# EasyEDA schematic SCH_DHT_projetos_2022-04-01.json
TITLE: Sheet_1; REV: 1.0; Date: 2022-03-18; Sheet: 1/1; Drawn By: GustavoHenrique; Company: Your Company
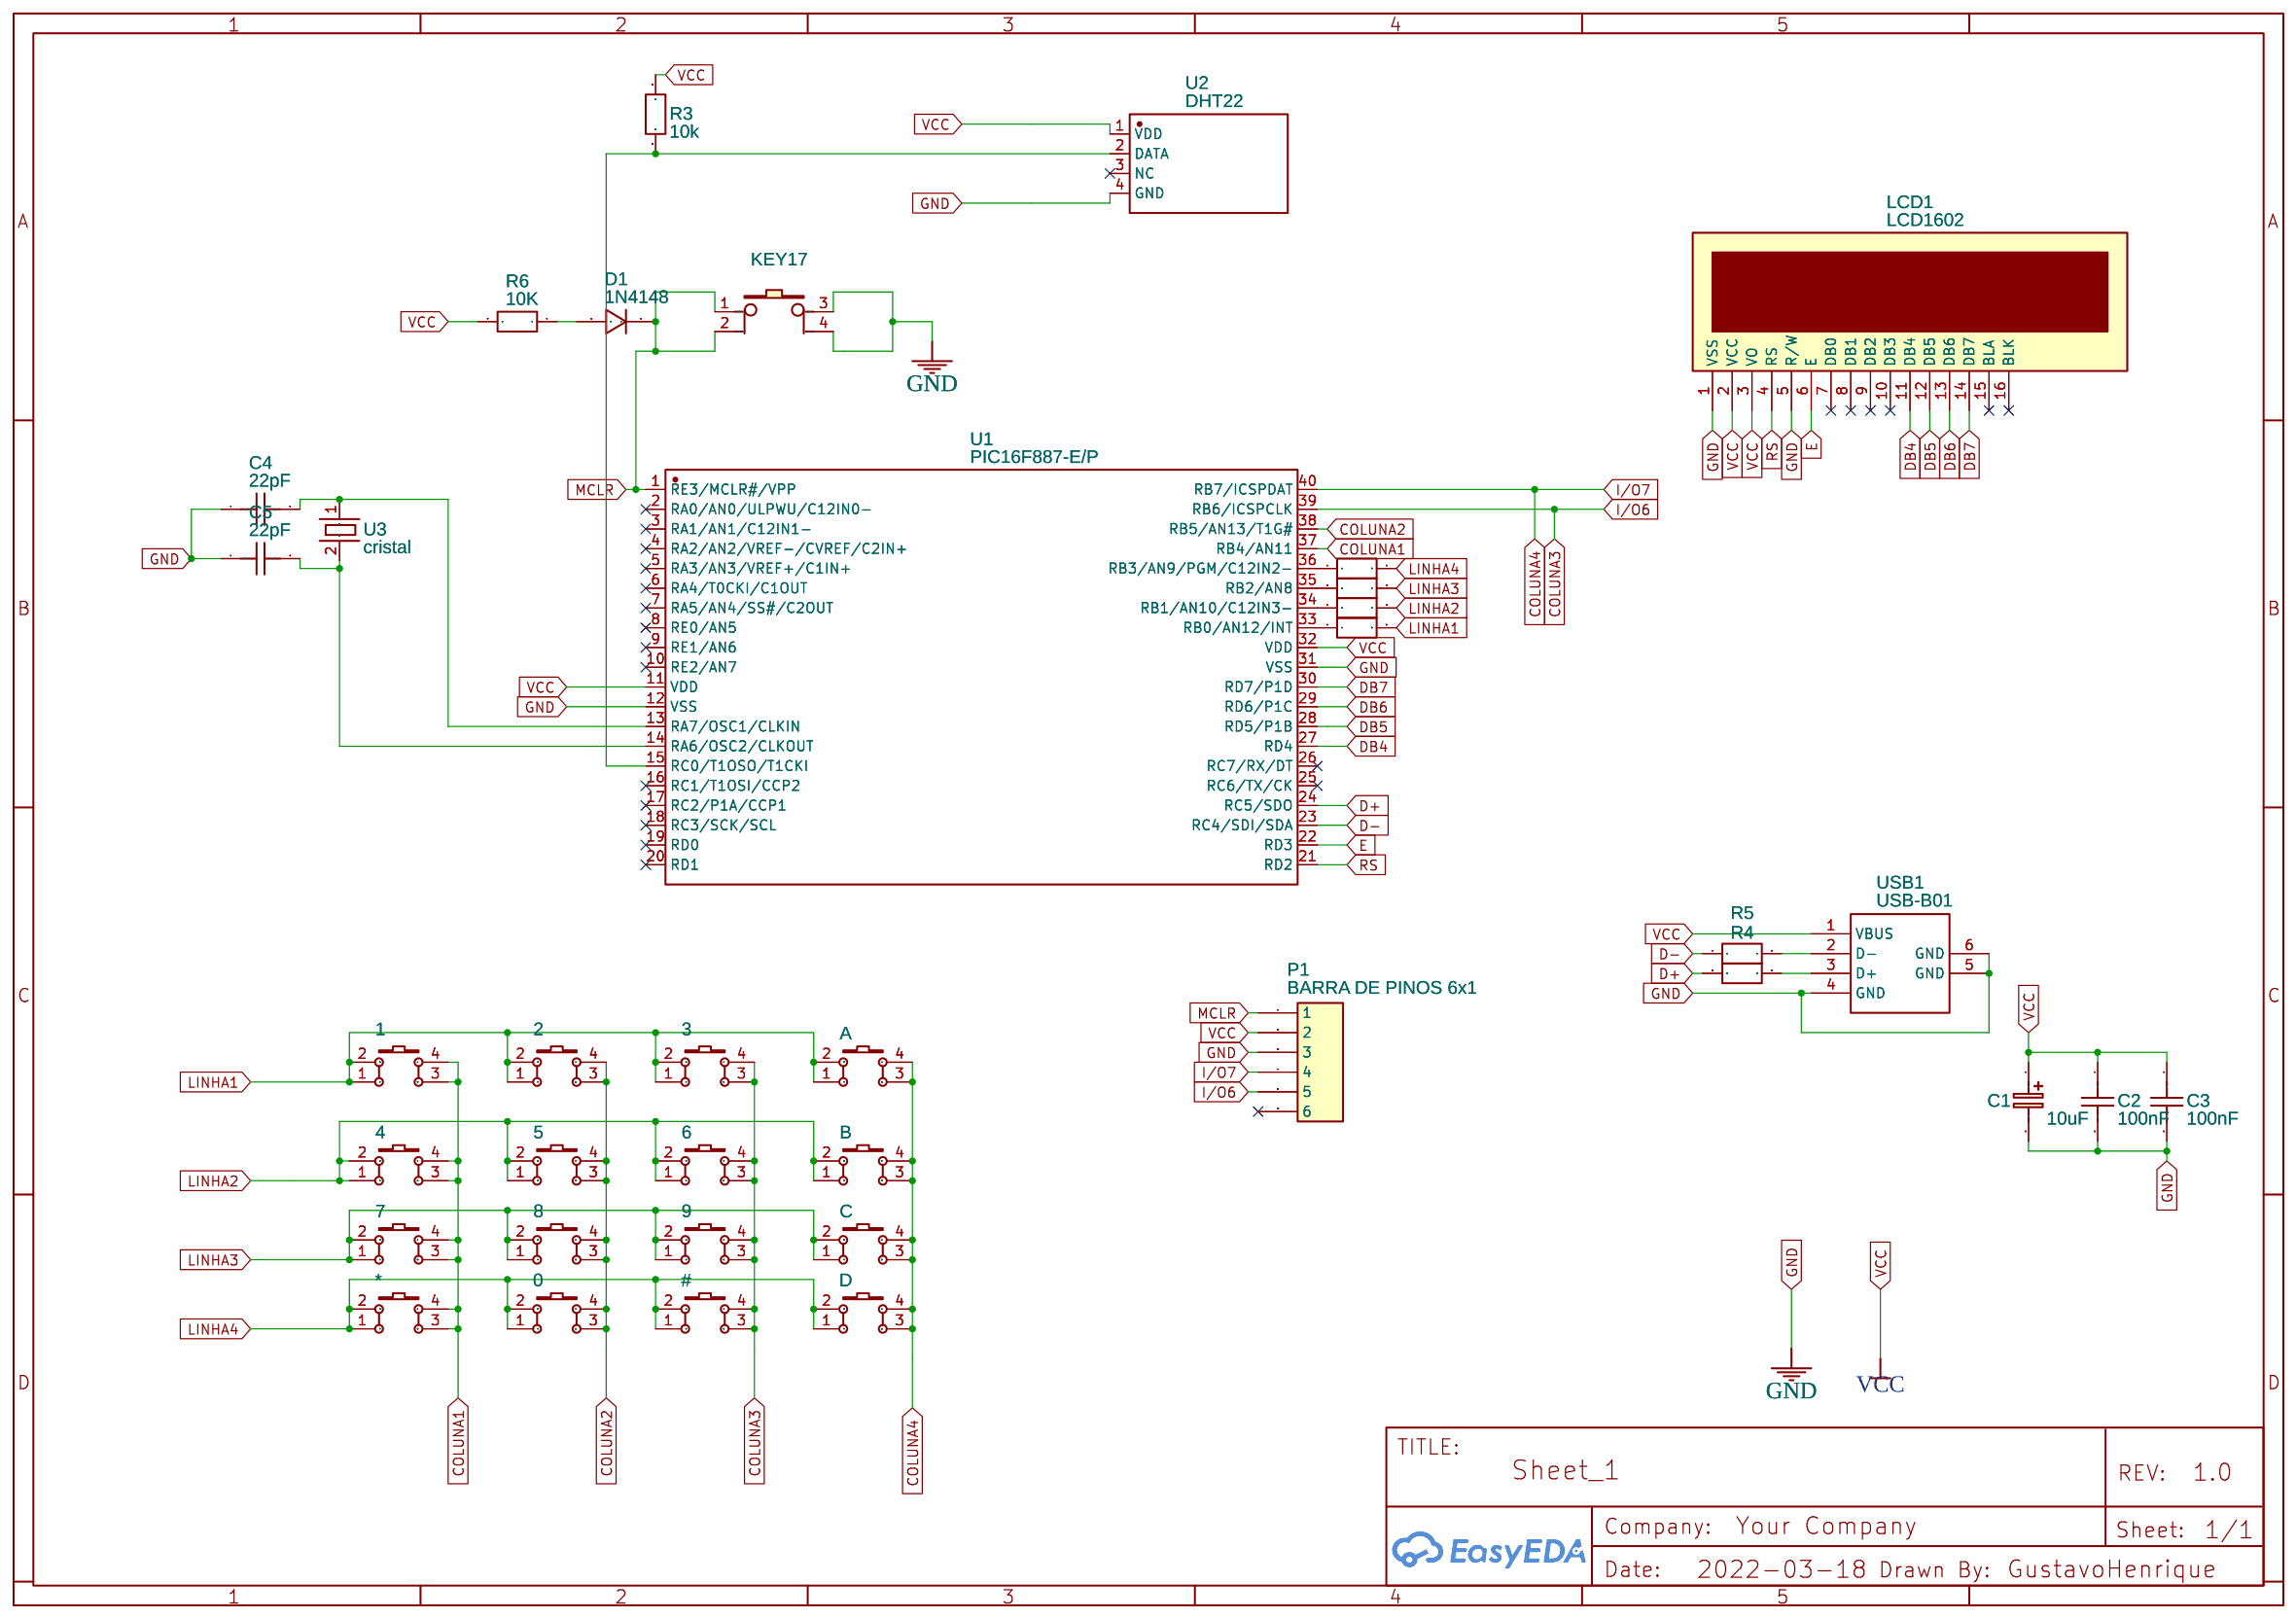
[diagram p0: schematic sheet]

## Parts
C1  10uF  [CASE-A_3216]
C2  100nF  [C0603]
C3  100nF  [C0603]
C4  22pF  [C0603]
C5  22pF  [C0603]
D1  1N4148  [SOD-123_L2.8-W1.8-LS3.7-RD]
KEY1  1  [KEY-TH_4P-L6.0-W6.0-P4.50-LS6.5]
KEY2  4  [KEY-TH_4P-L6.0-W6.0-P4.50-LS6.5]
KEY3  7  [KEY-TH_4P-L6.0-W6.0-P4.50-LS6.5]
KEY4  *  [KEY-TH_4P-L6.0-W6.0-P4.50-LS6.5]
KEY5  0  [KEY-TH_4P-L6.0-W6.0-P4.50-LS6.5]
KEY6  8  [KEY-TH_4P-L6.0-W6.0-P4.50-LS6.5]
KEY7  5  [KEY-TH_4P-L6.0-W6.0-P4.50-LS6.5]
KEY8  2  [KEY-TH_4P-L6.0-W6.0-P4.50-LS6.5]
KEY9  #  [KEY-TH_4P-L6.0-W6.0-P4.50-LS6.5]
KEY10  9  [KEY-TH_4P-L6.0-W6.0-P4.50-LS6.5]
KEY11  6  [KEY-TH_4P-L6.0-W6.0-P4.50-LS6.5]
KEY12  3  [KEY-TH_4P-L6.0-W6.0-P4.50-LS6.5]
KEY13  D  [KEY-TH_4P-L6.0-W6.0-P4.50-LS6.5]
KEY14  C  [KEY-TH_4P-L6.0-W6.0-P4.50-LS6.5]
KEY15  B  [KEY-TH_4P-L6.0-W6.0-P4.50-LS6.5]
KEY16  A  [KEY-TH_4P-L6.0-W6.0-P4.50-LS6.5]
KEY17  button6*6*8.5  [KEY-TH_4P-L6.0-W6.0-P4.50]
LCD1  LCD1602  [LCD1602]
P1  BARRA DE PINOS 6x1  [BARRA_PINOS7X2]
R1  1k  [R0603]
R2  1k  [R0603]
R3  10k  [R0603]
R4  27  [R0603]
R5  27  [R0603]
R6  10K  [R0603]
R7  1k  [R0603]
R8  1k  [R0603]
U1  PIC16F887-E/P  [PDIP-40_L52.3-W13.8-P2.54-LS15.2-BL]
U2  DHT22  [SENSOR-TH_DHT11]
U3  cristal  [CRISTAL]
USB1  USB-B01  [USB-B-TH_USB-B01]

## Library data of the parts
C1 = C_Tan_SMD_A_EU: Contributor: LCEDA_Lib
C2 C3 = C_0603_US: Contributor: LCEDA_Lib
C4 C5 = CS1608X7R105K250NRB: Supplier: LCSC; Supplier Part: C513775; Manufacturer: Samwha Capacitor; Contributor: LCSC; JLCPCB Part Class: Extended Part
D1 = 1N4007W: Supplier: LCSC; Supplier Part: C328592; Manufacturer: BLUE ROCKET; Contributor: LCEDA_Lib
KEY1-KEY16 = K4-6×6_TH: Supplier: LCSC; Supplier Part: C136684; Manufacturer: 韩国韩荣; Manufacturer Part: K2-1102DP-E4SW-04; Contributor: LCEDA_Lib
KEY17 = button6*6*8.5: Supplier Part: C59980; Supplier: LCSC; Manufacturer: ReliaPro
LCD1 = LCD1602: Manufacturer: LONTECH(厦门龙特); Manufacturer Part: LCM1602K-NSW-BBW; Supplier Part: C83275; Supplier: LCSC; Contributor: LCEDA_Lib
P1 = BARRA DE PINOS 6x1: Contributor: Projeto Simulador 737-800NG Simulando e Aprendendo!
R1-R8 = R_0603_EU: Contributor: LCEDA_Lib
U1 = PIC16F887-E/P: Supplier: LCSC; Supplier Part: C647863; Manufacturer: Microchip Tech; Contributor: LCSC; JLCPCB Part Class: Extended Part
U2 = DHT11: Supplier: LCSC; Supplier Part: C117051; Manufacturer: Aosong (Guangzhou) Elec; Contributor: LCSC; JLCPCB Part Class: Extended Part
U3 = cristal: Contributor: joao_almeida_diniz_jr
USB1 = USB-B01: Supplier: LCSC; Supplier Part: C498173; Manufacturer: SOFNG; Contributor: LCSC; JLCPCB Part Class: Extended Part

## Nets
GND: C1.2 C2.2 C3.2 C4.1 C5.1 KEY17.3 KEY17.4 LCD1.1(VSS) LCD1.5(R/W) P1.3 U1.12(VSS) U1.31(VSS) U2.4(GND) USB1.4(GND) USB1.5(GND) USB1.6(GND)
VCC: C1.1 C2.1 C3.1 LCD1.2(VCC) LCD1.3(VO) P1.2 R3.1 R6.2 U1.11(VDD) U1.32(VDD) U2.1(VDD) USB1.1(VBUS)
COLUNA1: KEY1.3 KEY1.4 KEY2.3 KEY2.4 KEY3.3 KEY3.4 KEY4.3 KEY4.4 U1.37(RB4/AN11)
COLUNA2: KEY5.3 KEY5.4 KEY6.3 KEY6.4 KEY7.3 KEY7.4 KEY8.3 KEY8.4 U1.38(RB5/AN13/T1G#)
COLUNA3: KEY9.3 KEY9.4 KEY10.3 KEY10.4 KEY11.3 KEY11.4 KEY12.3 KEY12.4 P1.5 U1.39(RB6/ICSPCLK)
COLUNA4: KEY13.3 KEY13.4 KEY14.3 KEY14.4 KEY15.3 KEY15.4 KEY16.3 KEY16.4 P1.4 U1.40(RB7/ICSPDAT)
D+: R4.1 U1.24(RC5/SDO)
D-: R5.1 U1.23(RC4/SDI/SDA)
DB4: LCD1.11(DB4) U1.27(RD4)
DB5: LCD1.12(DB5) U1.28(RD5/P1B)
DB6: LCD1.13(DB6) U1.29(RD6/P1C)
DB7: LCD1.14(DB7) U1.30(RD7/P1D)
E: LCD1.6(E) U1.22(RD3)
LINHA1: KEY1.1 KEY1.2 KEY8.1 KEY8.2 KEY12.1 KEY12.2 KEY16.1 KEY16.2 R8.2
LINHA2: KEY2.1 KEY2.2 KEY7.1 KEY7.2 KEY11.1 KEY11.2 KEY15.1 KEY15.2 R7.2
LINHA3: KEY3.1 KEY3.2 KEY6.1 KEY6.2 KEY10.1 KEY10.2 KEY14.1 KEY14.2 R2.2
LINHA4: KEY4.1 KEY4.2 KEY5.1 KEY5.2 KEY9.1 KEY9.2 KEY13.1 KEY13.2 R1.2
MCLR: D1.1 KEY17.1 KEY17.2 P1.1 U1.1(RE3/MCLR#/VPP)
RS: LCD1.4(RS) U1.21(RD2)
Net-(C4-2): C4.2 U1.13(RA7/OSC1/CLKIN) U3.1
Net-(C5-2): C5.2 U1.14(RA6/OSC2/CLKOUT) U3.2
Net-(D1-2): D1.2 R6.1
Net-(R1-1): R1.1 U1.36(RB3/AN9/PGM/C12IN2-)
Net-(R2-1): R2.1 U1.35(RB2/AN8)
Net-(R3-2): R3.2 U1.15(RC0/T1OSO/T1CKI) U2.2(DATA)
Net-(R4-2): R4.2 USB1.3(D+)
Net-(R5-2): R5.2 USB1.2(D-)
Net-(R7-1): R7.1 U1.34(RB1/AN10/C12IN3-)
Net-(R8-1): R8.1 U1.33(RB0/AN12/INT)

Not connected (* = marked no-connect by the designer): LCD1 7(DB0)* 8(DB1)* 9(DB2)* 10(DB3)* 15(BLA)* 16(BLK)*; P1 6*; U1 2(RA0/AN0/ULPWU/C12IN0-)* 3(RA1/AN1/C12IN1-)* 4(RA2/AN2/VREF-/CVREF/C2IN+)* 5(RA3/AN3/VREF+/C1IN+)* 6(RA4/T0CKI/C1OUT)* 7(RA5/AN4/SS#/C2OUT)* 8(RE0/AN5)* 9(RE1/AN6)* 10(RE2/AN7)* 16(RC1/T1OSI/CCP2)* 17(RC2/P1A/CCP1)* 18(RC3/SCK/SCL)* 19(RD0)* 20(RD1)* 25(RC6/TX/CK)* 26(RC7/RX/DT)*; U2 3(NC)*
